# Altium schematic sheet [6] Power_AFE.SchDoc
size A4
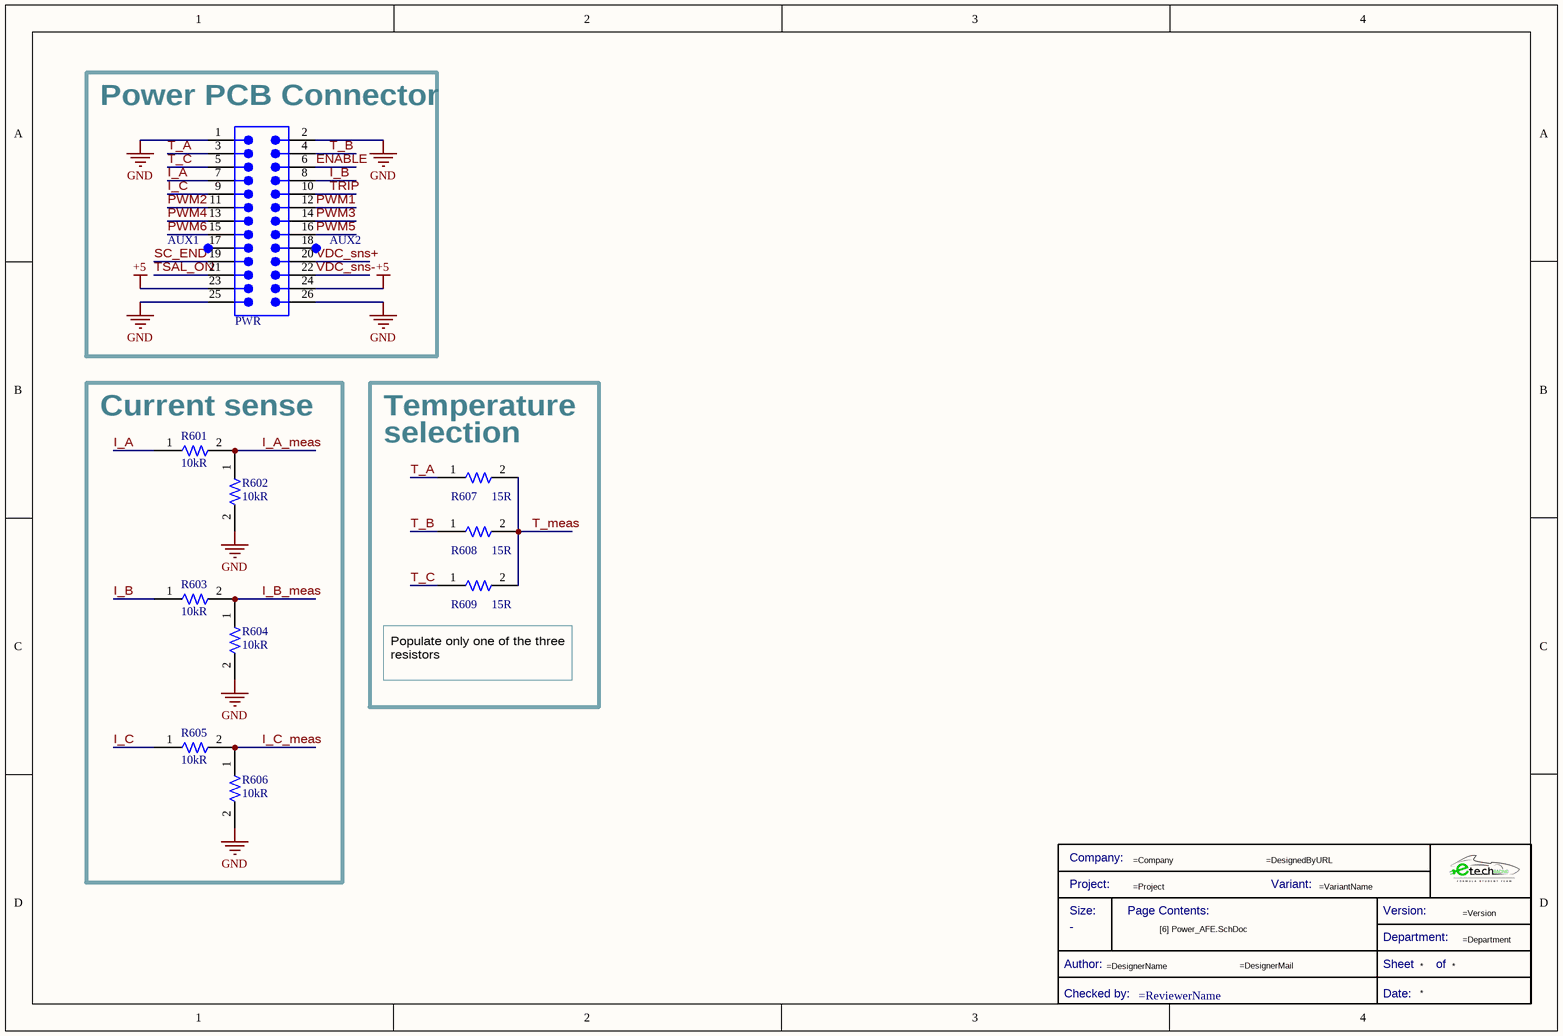
[diagram p0: [6] Power_AFE.SchDoc]

## Parts
*?  Title Block_template  (value not drawn)  (graphical)
AUX1  TestPoint  [TestPoint]  (value not drawn)  (no BOM)
AUX2  TestPoint  [TestPoint]  (value not drawn)  (no BOM)
PWR  61302621121  [61302621121]  (value not drawn)
R601  Resistance: 10kR  [R0805FTK]  (hidden comment: CR0805-JW-103ELF)
R602  Resistance: 10kR  [R0805FTK]  (hidden comment: CR0805-JW-103ELF)
R603  Resistance: 10kR  [R0805FTK]  (hidden comment: CR0805-JW-103ELF)
R604  Resistance: 10kR  [R0805FTK]  (hidden comment: CR0805-JW-103ELF)
R605  Resistance: 10kR  [R0805FTK]  (hidden comment: CR0805-JW-103ELF)
R606  Resistance: 10kR  [R0805FTK]  (hidden comment: CR0805-JW-103ELF)
R607  Resistance: 15R  [R0805FTK]  (hidden comment: CPF0805B15RE)
R608  Resistance: 15R  [R0805FTK]  (hidden comment: CPF0805B15RE)
R609  Resistance: 15R  [R0805FTK]  (hidden comment: CPF0805B15RE)

## Blocks framed on the sheet
Power PCB Connector: AUX1 AUX2 PWR
Current sense: R601-R606

## Nets
+5: PWR.23 PWR.24
GND: PWR.1 PWR.2 PWR.25 PWR.26 R602.2 R604.2 R606.2
ENABLE: PWR.6
I_A: PWR.7 R601.1
I_A_meas: R601.2 R602.1
I_B: PWR.8 R603.1
I_B_meas: R603.2 R604.1
I_C: PWR.9 R605.1
I_C_meas: R605.2 R606.1
PWM1: PWR.12
PWM2: PWR.11
PWM3: PWR.14
PWM4: PWR.13
PWM5: PWR.16
PWM6: PWR.15
SC_END: PWR.19
T_A: PWR.3 R607.1
T_B: PWR.4 R608.1
T_C: PWR.5 R609.1
T_meas: R607.2 R608.2 R609.2
TRIP: PWR.10
TSAL_ON: PWR.21
VDC_sns+: PWR.20
VDC_sns-: PWR.22
NetAUX1_1: AUX1.1(TP) PWR.17
NetAUX2_1: AUX2.1(TP) PWR.18

## Notes on the sheet
- Temperature
- (near R607) selection
- (near R609) Populate only one of the three resistors
- (in symbol Title Block_template) Company:; Project:; Variant:; Size:; Page Contents:; Version:; Department:; Author:; Sheet; of; Checked by:; Date:

## Library data of the parts
*? = Title Block_template: Standard Title Block; .Creator: GP; Category: Title Block; .PCBcheck: GP; .SCHcheck: GP; Checked by:: =ReviewerName; Size: -
AUX1 AUX2 = TestPoint: Test Point 1x1 mm; .Creator: GP; Category: TestPoint; .PCBcheck: GP; .SCHcheck: GP
PWR = 61302621121: WR-PHD Pin Header, THT, Vertical, pitch 2.54mm, 2 Row, 26P; Manufacturer: Wurth Elektronik; Contact Resistance: 20mOhm; Rated Current: 3A; Working Voltage: 250V; Withstanding Voltage: 500V; Manufacturer Part Number: 61302621121; Category: Board-to-Board Connectors; Match Code: WR-PHD; ComponentLink1Description: Website Link; ComponentLink1URL: https://www.we-online.com/redexpert/article/61302621121?ad; ComponentLink2Description: Datasheet Link; ComponentLink2URL: https://www.we-online.com/redexpert/spec/61302621121?ad; Mount: Through Hole; Operating Temperature Max: 105°C; Operating Temperature Min: -40°C; Packaging: Bag; Gender: Pin Header; Number of Pins: 26; Number of Rows: 2; Orientation: Vertical; Pitch: 2.54mm
R601-R606 = R10k-0805FTK: BOURNS         CR0805-JW-103ELF            Surface Mount Chip Resistor, Thick Film, CR Series, 10 kohm, 125 mW,  5%, 150 V; Temperature Coefficient: 200ppm/°C; Power Rating: 125mW; Voltage Rating: 150V; Voltage Rating (DC): 100V; .Creator: DR; Supplier 1: Arrow Electronics; Manufacturer 1: Bourns; Manufacturer Part Number 1: CR0805-JW-103ELF; RoHS: Yes; Category: Chip SMD Resistors; Stock 1: 57566; Pricing 1: 1=0,05790, 10=0,01540, 25=0,01340, 100=0,00340 (USD); Mount: Surface Mount; Case/Package: 0805; Number of Pins: 2; Contact Plating: Tin; Case Code (Metric): 2012; Case Code (Imperial): 0805; Min Operating Temperature: -55°C; Max Operating Temperature: 155°C; Tolerance: 5%; Resistor Type: Thick Film; Package Quantity: 1; Packaging: Tape and Reel; Number of Terminations: 2; Termination: SMD/SMT; Max Power Dissipation: 125mW; Features: Moisture Resistant; Series: CR0805; Construction: Rectangular; Resistance Tolerance: 5%; Technology: THICK FILM; Length: 2mm; Width: 1.25mm; Height: 0.5mm; Depth: 1.25mm; Thickness: 508um; Radiation Hardening: No; REACH SVHC: No SVHC; Military Standard: Not; RoHS Compliant: Yes; ComponentLink1URL: https://datasheet.ciiva.com/11821/0900766b80fcdb72-11821135.pdf?src-supplier=RSComponents; ComponentLink1Description: https://datasheet.ciiva.com/11821/0900766b80fcdb72-11821135.pdf?src-supplier=RSComponents; ComponentLink2URL: https://datasheet.ciiva.com/9122/chpreztr-9122374.pdf?src-supplier=Avnet; ComponentLink2Description: https://datasheet.ciiva.com/9122/chpreztr-9122374.pdf?src-supplier=Avnet; ComponentLink3URL: https://datasheet.ciiva.com/22693/1902866-22693254.pdf?src-supplier=Element14; ComponentLink3Description: https://datasheet.ciiva.com/22693/1902866-22693254.pdf?src-supplier=Element14; ComponentLink4URL: https://datasheet.ciiva.com/7986/691949-7986187.pdf?src-supplier=Element14; ComponentLink4Description: https://datasheet.ciiva.com/7986/691949-7986187.pdf?src-supplier=Element14; ComponentLink5URL: https://datasheet.ciiva.com/30065/159chpreztr-30065976.pdf?src-supplier=Onlinecomponents.com; ComponentLink5Description: https://datasheet.ciiva.com/30065/159chpreztr-30065976.pdf?src-supplier=Onlinecomponents.com; ComponentLink6URL: https://datasheet.ciiva.com/16783/70154685-16783482.pdf?src-supplier=Allied+Electronics; ComponentLink6Description: https://datasheet.ciiva.com/16783/70154685-16783482.pdf?src-supplier=Allied+Electronics; ComponentLink7URL: https://datasheet.ciiva.com/5548/chpreztr-5548491.pdf?src-supplier=Mouser; ComponentLink7Description: https://datasheet.ciiva.com/5548/chpreztr-5548491.pdf?src-supplier=Mouser; ComponentLink8URL: https://datasheet.ciiva.com/6559/chpreztr-6559900.pdf?src-supplier=Digi-Key; ComponentLink8Description: https://datasheet.ciiva.com/6559/chpreztr-6559900.pdf?src-supplier=Digi-Key; ComponentLink9URL: https://datasheet.ciiva.com/6559/chpreztr-6559901.pdf?src-supplier=Digi-Key; ComponentLink9Description: https://datasheet.ciiva.com/6559/chpreztr-6559901.pdf?src-supplier=Digi-Key; ComponentLink10URL: https://datasheet.ciiva.com/7985/1856384-7985869.pdf?src-supplier=Element14; ComponentLink10Description: https://datasheet.ciiva.com/7985/1856384-7985869.pdf?src-supplier=Element14; ComponentLink11URL: https://datasheet.ciiva.com/48692/001055517-da-01-en-smd-wid-cr0805-jw-103elf-10k-ohm-1-8w-48692118.pdf?src-supplier=Conrad; ComponentLink11Description: https://datasheet.ciiva.com/48692/001055517-da-01-en-smd-wid-cr0805-jw-103elf-10k-ohm-1-8w-48692118.pdf?src-supplier=Conrad; Supplier Part Number 1: CR0805-JW-103ELF
R607-R609 = R15-0805FTN: TE Connectivity CPF Series Precision Thin Film Surface Mount Resistor 0805 Case 15 0.1% 0.1W 25ppm/C; Temperature Coefficient: 25ppm/°C; Power Rating: 100mW; .Creator: DR; Category: Resistor; ComponentLink1Description: Datasheet; ComponentLink2Description: Where buy it; Supplier 1: RSComponents; Manufacturer: TE Connectivity; Manufacturer Part Number: CPF0805B15RE; RoHS: Yes; Stock 1: 1; Pricing 1: 5=0,35100, 50=0,32700, 100=0,30500, 250=0,28400, 500=0,25900 (USD); Mount: Surface Mount; Case/Package: 0805; Min Operating Temperature: -55°C; Max Operating Temperature: 125°C; Tolerance: 0.1%; Termination: SMD/SMT; Length: 2mm; Height: 0.5mm; Depth: 1.25mm; ComponentLink3URL: https://datasheet.ciiva.com/11812/0900766b80cecff9-11812882.pdf?src-supplier=RSComponents; ComponentLink3Description: https://datasheet.ciiva.com/11812/0900766b80cecff9-11812882.pdf?src-supplier=RSComponents; Supplier Part Number 1: 6662373